# EAGLE design draft4_4lyr_autoroute (EAGLE 6.1)
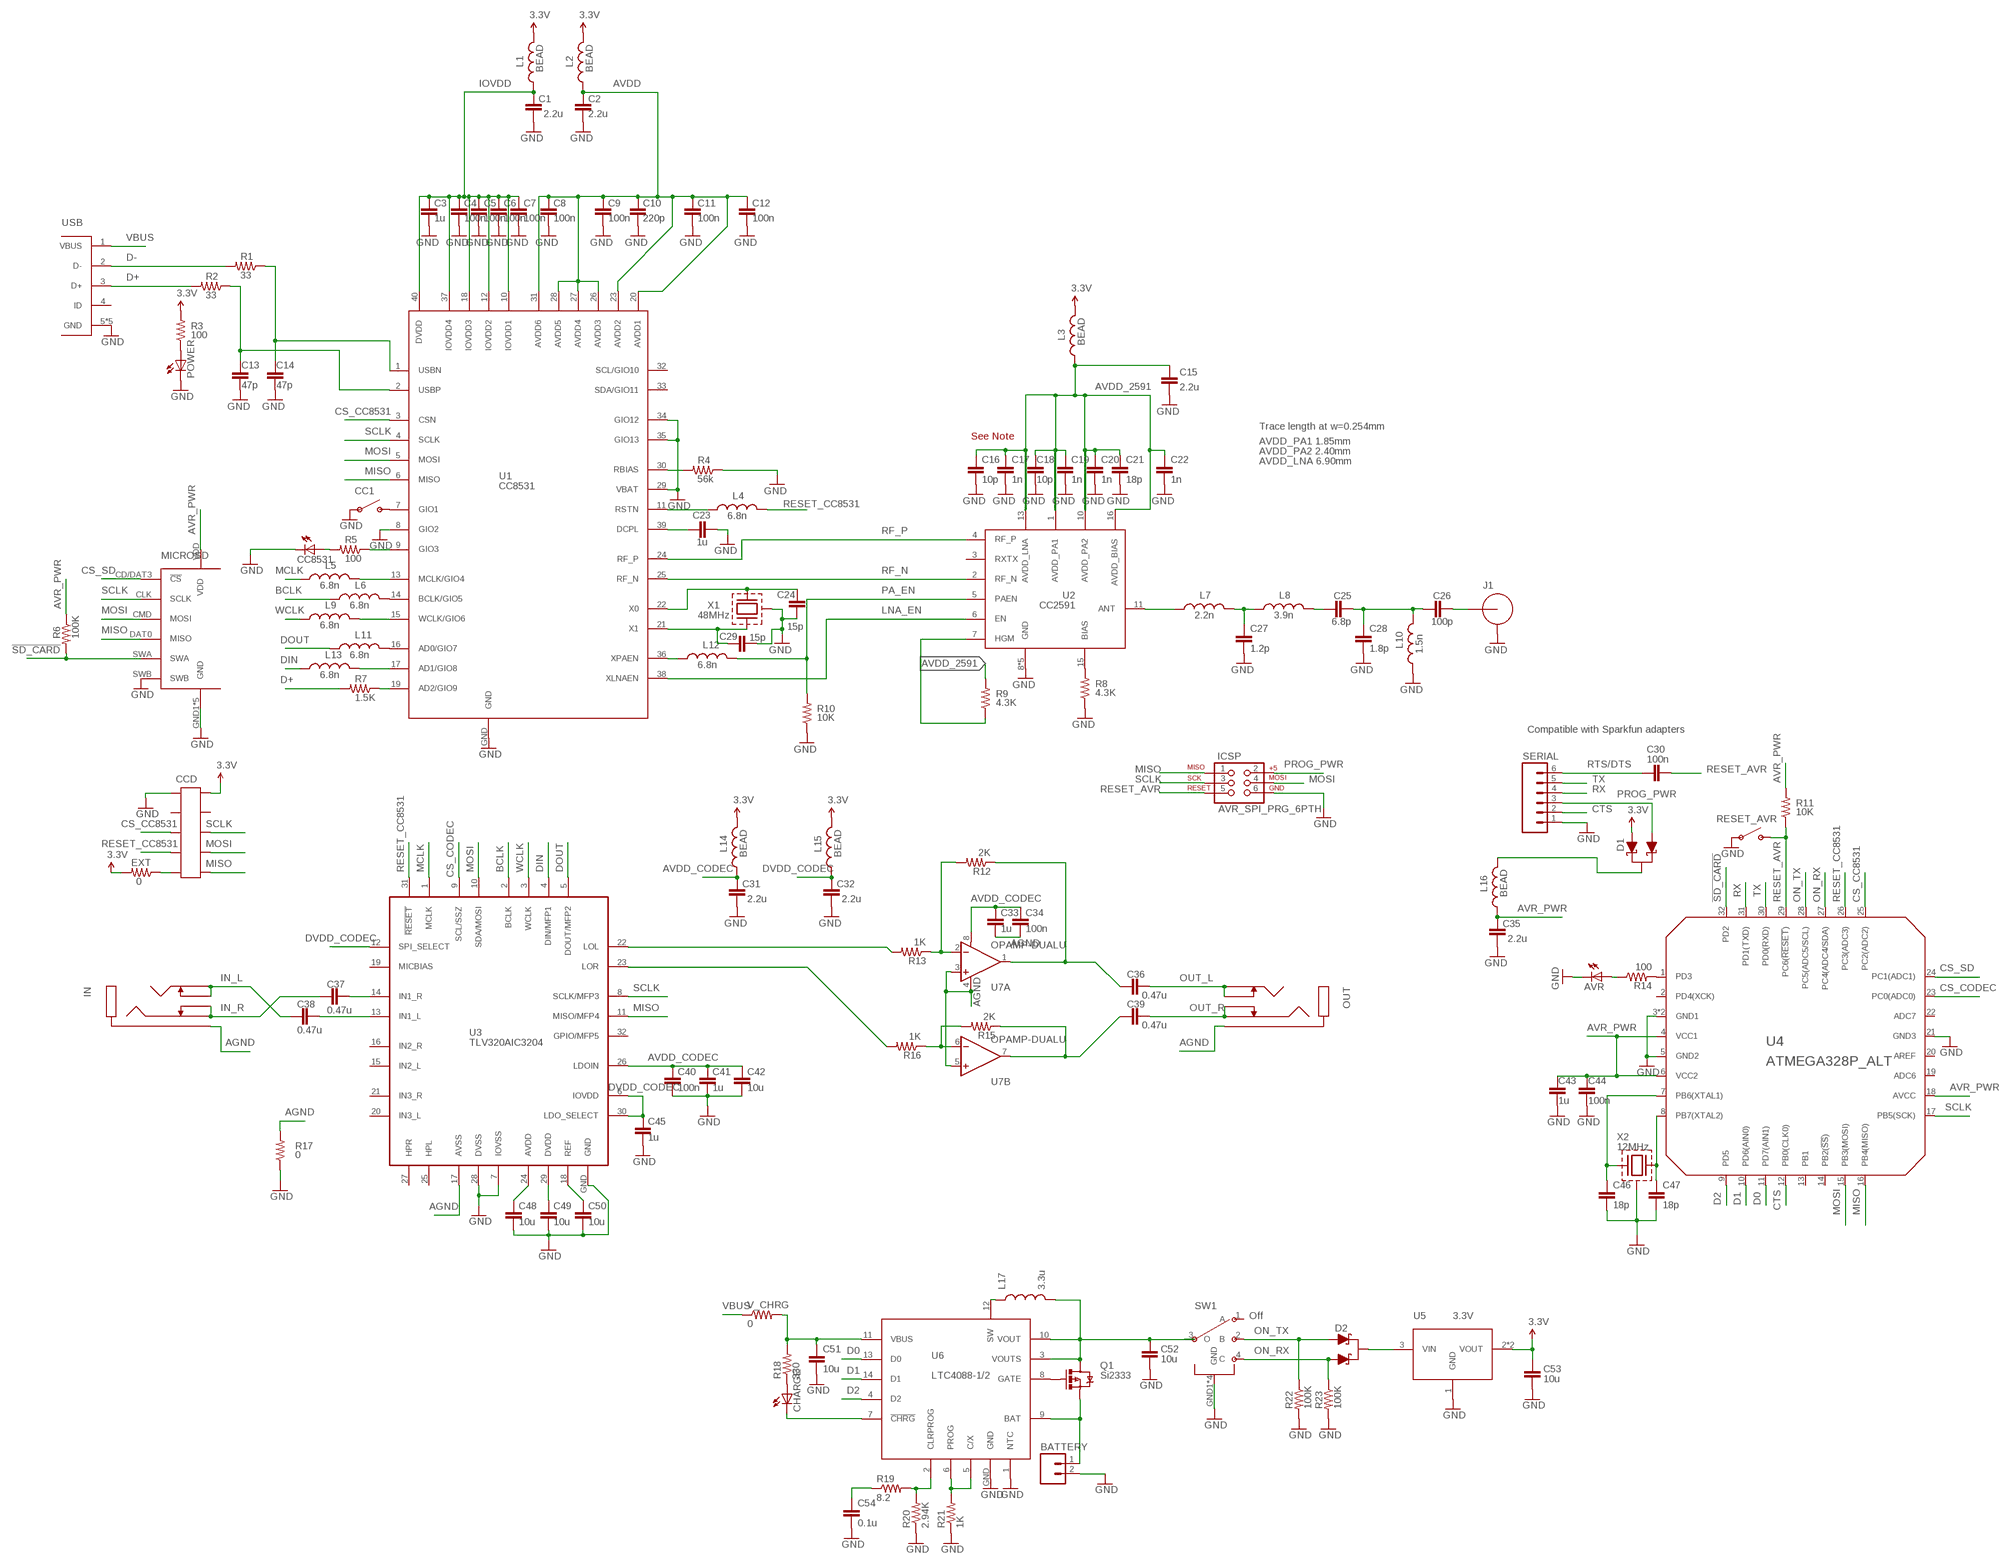
[diagram p0: schematic, sheet 1]

## Parts
AVR  LED1206  [LED-1206]
BATTERY  M02-JST-2MM-SMT  [JST-2-SMD]
C1  2.2u  C-EUC0603  [C0603]
C2  2.2u  C-EUC0603  [C0603]
C3  1u  C-EUC0603  [C0603]
C4  100n  C-EUC0603  [C0603]
C5  100n  C-EUC0603  [C0603]
C6  100n  C-EUC0603  [C0603]
C7  100n  C-EUC0603  [C0603]
C8  100n  C-EUC0603  [C0603]
C9  100n  C-EUC0603  [C0603]
C10  220p  C-EUC0603  [C0603]
C11  100n  C-EUC0603  [C0603]
C12  100n  C-EUC0603  [C0603]
C13  47p  C-EUC0603  [C0603]
C14  47p  C-EUC0603  [C0603]
C15  2.2u  C-EUC0603  [C0603]
C16  10p  C-EUC0603  [C0603]
C17  1n  C-EUC0603  [C0603]
C18  10p  C-EUC0603  [C0603]
C19  1n  C-EUC0603  [C0603]
C20  1n  C-EUC0603  [C0603]
C21  18p  C-EUC0603  [C0603]
C22  1n  C-EUC0603  [C0603]
C23  1u  C-EUC0603  [C0603]
C24  15p  C-EUC0603  [C0603]
C25  6.8p  C-EUC0603  [C0603]
C26  100p  C-EUC0603  [C0603]
C27  1.2p  C-EUC0603  [C0603]
C28  1.8p  C-EUC0603  [C0603]
C29  15p  C-EUC0603  [C0603]
C30  100n  C-EUC0603  [C0603]
C31  2.2u  C-EUC0603  [C0603]
C32  2.2u  C-EUC0603  [C0603]
C33  1u  C-EUC0603  [C0603]
C34  100n  C-EUC0603  [C0603]
C35  2.2u  C-EUC0603  [C0603]
C36  0.47u  C-EUC0603  [C0603]
C37  0.47u  C-EUC0603  [C0603]
C38  0.47u  C-EUC0603  [C0603]
C39  0.47u  C-EUC0603  [C0603]
C40  100n  C-EUC0603  [C0603]
C41  1u  C-EUC0603  [C0603]
C42  10u  C-EUC0603  [C0603]
C43  1u  C-EUC0603  [C0603]
C44  100n  C-EUC0603  [C0603]
C45  1u  C-EUC0603  [C0603]
C46  18p  C-EUC0603  [C0603]
C47  18p  C-EUC0603  [C0603]
C48  10u  C-EUC0603  [C0603]
C49  10u  C-EUC0603  [C0603]
C50  10u  C-EUC0603  [C0603]
C51  10u  C-EUC0603  [C0603]
C52  10u  C-EUC0603  [C0603]
C53  10u  C-EUC0603  [C0603]
C54  0.1u  C-EUC0603  [C0603]
CC1  SPST-SMD  [TACT_SW]
CC8531  LED1206  [LED-1206]
CCD  HEADER-10P-PTH-MALE  [2X5]
CHARGE  LED1206  [LED-1206]
D1  DUAL_SCHOTTKY  [SOT-23]
D2  DUAL_SCHOTTKY  [SOT-23]
EXT  0  R-US_R0603  [R0603]
ICSP  AVR_SPI_PRG_6PTH  [2X3]
IN  PHONE_SW  [35RAPC4BV4]
J1  SMA  [CONSMA003.031]
L1  BEAD  INDUCTOR0603  [0603]
L2  BEAD  INDUCTOR0603  [0603]
L3  BEAD  INDUCTOR0603  [0603]
L4  6.8n  INDUCTOR0603  [0603]
L5  6.8n  INDUCTOR0603  [0603]
L6  6.8n  INDUCTOR0603  [0603]
L7  2.2n  INDUCTOR0603  [0603]
L8  3.9n  INDUCTOR0603  [0603]
L9  6.8n  INDUCTOR0603  [0603]
L10  1.5n  INDUCTOR0603  [0603]
L11  6.8n  INDUCTOR0603  [0603]
L12  6.8n  INDUCTOR0603  [0603]
L13  6.8n  INDUCTOR0603  [0603]
L14  BEAD  INDUCTOR0603  [0603]
L15  BEAD  INDUCTOR0603  [0603]
L16  BEAD  INDUCTOR0603  [0603]
L17  3.3u  IFSC-1111AB-01  [IFSC-1111AB-01]
MICROSD  MICROSD104031-0811  [MOLEX_104031-0811]
OUT  PHONE_SW  [35RAPC4BV4]
POWER  LED1206  [LED-1206]
Q1  Si2333  MOSFET-PCHANNELSMD  [SOT23-3]
R1  33  R-US_R0603  [R0603]
R2  33  R-US_R0603  [R0603]
R3  100  R-US_R0603  [R0603]
R4  56k  R-US_R0603  [R0603]
R5  100  R-US_R0603  [R0603]
R6  100K  R-US_R0603  [R0603]
R7  1.5K  R-US_R0603  [R0603]
R8  4.3K  R-US_R0603  [R0603]
R9  4.3K  R-US_R0603  [R0603]
R10  10K  R-US_R0603  [R0603]
R11  10K  R-US_R0603  [R0603]
R12  2K  R-US_R0603  [R0603]
R13  1K  R-US_R0603  [R0603]
R14  100  R-US_R0603  [R0603]
R15  2K  R-US_R0603  [R0603]
R16  1K  R-US_R0603  [R0603]
R17  0  R-US_R0603  [R0603]
R18  330  R-US_R0603  [R0603]
R19  8.2  R-US_R0603  [R0603]
R20  2.94K  R-US_R0603  [R0603]
R21  1K  R-US_R0603  [R0603]
R22  100K  R-US_R0603  [R0603]
R23  100K  R-US_R0603  [R0603]
RESET_AVR  SPST-SMD  [TACT_SW]
SERIAL  M06SIP  [1X06]
SW1  SP3T-SSSS812201  [SSSS812201]
U1  CC8531  [S-PVQFN-N40]
U2  CC2591  [S-PVQFN-N16]
U3  TLV320AIC3204  [S-PVQFN-N32]
U4  ATMEGA328P_ALT  [S-PQFP-N32]
U5  3.3V  NX1117C  [SOT-223]
U6  LTC4088-1/2  [DFN-14]
U7  OPAMP-DUALU  [SO08]
USB  USB_MICRO_AB  [USB_MICRO_AB]
V_CHRG  0  R-US_R0603  [R0603]
X1  48MHz  XTAL-ABRACONABM3C  [ABM3C]
X2  12MHz  XTAL-ABRACONABM8G  [ABM8G]

## Nets
3.3V [Power]: C53.1 CCD.2 D1.1(A1) EXT.2 L1.2 L2.2 L3.2 L14.2 L15.2 R3.2 U5.2(VOUT) U5.4(VOUT)
!SD_CARD: MICROSD.SWA R6.2 U4.32(PD2)
AGND [Analog]: C33.2 C34.2 IN.1(GND) OUT.1(GND) R17.2 U3.17(AVSS) U7.3(A:+IN) U7.4(A:V-) U7.5(B:+IN)
AVDD: C2.1 C8.1 C9.1 C10.1 C11.1 C12.1 L2.1 U1.20(AVDD1) U1.23(AVDD2) U1.26(AVDD3) U1.27(AVDD4) U1.28(AVDD5) U1.31(AVDD6)
AVDD_2591: C15.1 C16.1 C17.1 C18.1 C19.1 C20.1 C21.1 C22.1 L3.1 R9.2 U2.1(AVDD_PA1) U2.10(AVDD_PA2) U2.13(AVDD_LNA) U2.16(AVDD_BIAS)
AVDD_CODEC: C31.1 C33.1 C34.1 C40.1 C41.1 C42.1 L14.1 U3.26(LDOIN) U7.8(A:V+)
AVR_PWR: C35.1 C43.1 C44.1 L16.1 MICROSD.VDD R6.1 R11.2 U4.4(VCC1) U4.6(VCC2) U4.18(AVCC)
BAT [Power]: BATTERY.1 Q1.2(S) U6.9(BAT)
BCLK: L6.1 U3.2(BCLK)
CS_CC8531: CCD.5 U1.3(CSN) U4.25(PC2(ADC2))
CS_CODEC: U3.9(SCL/SSZ) U4.23(PC0(ADC0))
CS_SD: MICROSD.CD/DAT3(!CS) U4.24(PC1(ADC1))
CTS: SERIAL.2 U4.12(PB0(CLK0))
D0: U4.11(PD7(AIN1)) U6.13(D0)
D1: U4.10(PD6(AIN0)) U6.14(D1)
D2: U4.9(PD5) U6.4(D2)
D+: R2.2 R7.2 USB.3(D+)
D-: R1.2 USB.2(D-)
DIN: L13.1 U3.4(DIN/MFP1)
DOUT: L11.1 U3.5(DOUT/MFP2)
DVDD: C49.1 U3.29(DVDD)
DVDD_CODEC: C32.1 C45.1 L15.1 U3.6(IOVDD) U3.12(SPI_SELECT) U3.30(LDO_SELECT)
GND [Power]: AVR.C BATTERY.2 C1.2 C2.2 C3.2 C4.2 C5.2 C6.2 C7.2 C8.2 C9.2 C10.2 C11.2 C12.2 C13.2 C14.2 C15.2 C16.2 C17.2 C18.2 C19.2 C20.2 C21.2 C22.2 C23.2 C24.2 C27.2 C28.2 C29.2 C31.2 C32.2 C35.2 C40.2 C41.2 C42.2 C43.2 C44.2 C45.2 C46.2 C47.2 C48.2 C49.2 C50.2 C51.2 C52.2 C53.2 C54.2 CC1.1 CC1.2 CC8531.C CCD.1 ICSP.6 J1.GND1(GND) J1.GND2(GND) J1.GND3(GND) J1.GND4(GND) L10.1 MICROSD.GND1(GND) MICROSD.GND2(GND) MICROSD.GND3(GND) MICROSD.GND4(GND) MICROSD.SWB MICROSD.VSS(GND) POWER.C R4.1 R8.1 R10.1 R17.1 R20.1 R21.1 R22.2 R23.2 RESET_AVR.1 RESET_AVR.2 SERIAL.1 SW1.GND1(GND) SW1.GND2(GND) SW1.GND3(GND) SW1.GND4(GND) U1.8(GIO2) U1.29(VBAT) U1.34(GIO12) U1.35(GIO13) U1.GND U2.8(GND) U2.9(GND) U2.12(GND) U2.14(GND) U2.GND U3.7(IOVSS) U3.28(DVSS) U3.GND U4.3(GND1) U4.5(GND2) U4.21(GND3) U4.P$1(GND1) U5.1(GND) U6.1(NTC) U6.GND USB.5(GND) USB.GND1(GND) USB.GND2(GND) USB.GND3(GND) USB.GND4(GND) X1.2(CASE) X1.4(CASE) X2.GND-1(CASE) X2.GND-2(CASE)
IN_L [Analog]: C38.1 IN.2(L) IN.5(L_SW)
IN_R [Analog]: C37.1 IN.3(R_SW) IN.4(R)
IOVDD: C1.1 C3.1 C4.1 C5.1 C6.1 C7.1 L1.1 U1.10(IOVDD1) U1.12(IOVDD2) U1.18(IOVDD3) U1.37(IOVDD4) U1.40(DVDD)
IOVDD1: C14.1 R1.1 U1.1(USBN)
IOVDD2: C13.1 R2.1 U1.2(USBP)
LNA_EN: U1.38(XLNAEN) U2.6(EN)
MCLK: L5.1 U3.1(MCLK)
MISO: CCD.10 ICSP.1 MICROSD.DAT0(MISO) U1.6(MISO) U3.11(MISO/MFP4) U4.16(PB4(MISO))
MOSI: CCD.8 ICSP.4 MICROSD.CMD(MOSI) U1.5(MOSI) U3.10(SDA/MOSI) U4.15(PB3(MOSI))
N$1: C29.1 U1.21(X1) X1.1
N$2: C24.1 U1.22(X0) X1.3
N$3: L4.1 U1.11(RSTN)
N$4: L11.2 U1.16(AD0/GIO7)
N$5: L6.2 U1.14(BCLK/GIO5)
N$6: D1.3(C1) L16.2
N$7: R8.2 U2.15(BIAS)
N$8: R9.1 U2.7(HGM)
N$9: C26.2 J1.SIG
N$10: D2.3(C1) U5.3(VIN)
N$11: CC1.3 CC1.4 U1.7(GIO1)
N$12: C46.1 U4.7(PB6(XTAL1)) X2.X1
N$13: L7.1 U2.11(ANT)
N$14: C27.1 L7.2 L8.1
N$15: C25.1 L8.2
N$16: C25.2 C26.1 C28.1 L10.2
N$17: C48.1 U3.24(AVDD)
N$18: L12.1 U1.36(XPAEN)
N$19: R4.2 U1.30(RBIAS)
N$20: C47.1 U4.8(PB7(XTAL2)) X2.X2
N$21: C23.1 U1.39(DCPL)
N$23: L5.2 U1.13(MCLK/GIO4)
N$24: R7.1 U1.19(AD2/GIO9)
N$25: L9.2 U1.15(WCLK/GIO6)
N$27: L13.2 U1.17(AD1/GIO8)
N$28: R5.1 U1.9(GIO3)
N$29: CC8531.A R5.2
N$31: POWER.A R3.1
N$32: CHARGE.C U6.7(!CHRG)
N$33: CHARGE.A R18.1
N$34 [Analog]: C37.2 U3.14(IN1_R)
N$35 [Analog]: C38.2 U3.13(IN1_L)
N$36: L17.1 U6.12(SW)
N$37: R21.2 U6.5(C/X) U6.6(PROG)
N$38: R19.2 R20.2 U6.2(CLRPROG)
N$39: C36.1 R12.1 U7.1(A:OUT)
N$40: C39.1 R15.1 U7.7(B:OUT)
N$46: R14.2 U4.1(PD3)
N$47: AVR.A R14.1
N$48: C54.1 R19.1
N$49 [Power]: C52.1 L17.2 Q1.3(D) SW1.3(O) U6.3(VOUTS) U6.10(VOUT)
N$50: CCD.9 EXT.1
N$51: Q1.1(G) U6.8(GATE)
N$52 [Power]: C51.1 R18.2 U6.11(VBUS) V_CHRG.2
N$53: R12.2 R13.1 U7.2(A:-IN)
N$54: R15.2 R16.1 U7.6(B:-IN)
N$55: R13.2 U3.22(LOL)
N$56: R16.2 U3.23(LOR)
ON_RX: D2.2(A) R23.1 SW1.4(C) U4.27(PC4(ADC4/SDA))
ON_TX: D2.1(A1) R22.1 SW1.2(B) U4.28(PC5(ADC5/SCL))
OUT_L [Analog]: C36.2 OUT.2(L) OUT.5(L_SW)
OUT_R [Analog]: C39.2 OUT.3(R_SW) OUT.4(R)
PA_EN: L12.2 R10.2 U2.5(PAEN)
PROG_PWR: D1.2(A) ICSP.2 SERIAL.3
REF: C50.1 U3.18(REF)
RESET_AVR: C30.2 ICSP.5 R11.1 RESET_AVR.3 RESET_AVR.4 U4.29(PC6(!RESET!))
RESET_CC8531: CCD.7 L4.2 U3.31(!RESET) U4.26(PC3(ADC3))
RF_N: U1.25(RF_N) U2.2(RF_N)
RF_P: U1.24(RF_P) U2.4(RF_P)
RTS/DTS: C30.1 SERIAL.6
RX: SERIAL.4 U4.31(PD1(TXD))
SCLK: CCD.6 ICSP.3 MICROSD.CLK(SCLK) U1.4(SCLK) U3.8(SCLK/MFP3) U4.17(PB5(SCK))
TX: SERIAL.5 U4.30(PD0(RXD))
VBUS [Power]: USB.1(VBUS) V_CHRG.1
WCLK: L9.1 U3.3(WCLK)
Unconnected: CCD.3 CCD.4 SW1.1(A) U1.32(SCL/GIO10) U1.33(SDA/GIO11) U2.3(RXTX) U3.15(IN2_L) U3.16(IN2_R) U3.19(MICBIAS) U3.20(IN3_L) U3.21(IN3_R) U3.25(HPL) U3.27(HPR) U3.32(GPIO/MFP5) U4.2(PD4(XCK)) U4.13(PB1) U4.14(PB2(!SS!)) U4.19(ADC6) U4.20(AREF) U4.22(ADC7) USB.4(ID)

## Notes on the sheet
- Trace length at w=0.254mm
- See Note
- AVDD_PA1 1.85mm
- AVDD_PA2 2.40mm
- AVDD_LNA 6.90mm
- Compatible with Sparkfun adapters
- Off

## Library data of the parts
AVR CC8531 CHARGE POWER = SparkFun-LED:LED: LEDs Standard schematic elements and footprints for 5mm, 3mm, 1206, and 0603 sized LEDs. 5mm - Spark Fun Electronics SKU : COM-00529 (and others)
BATTERY = SparkFun-Connectors:M02: Header 2 Standard 2-pin 0.1" header. Use with straight break away headers (SKU : PRT-00116), right angle break away headers (PRT-00553), swiss pins (PRT-00743), machine pins (PRT-00117), and female headers (PRT-00115). Molex polarized connector foot print use with SKU : PRT-08233 with associated crimp pins and housings.
C1-C45 C48-C50 C52 C53 = rcl:C-EU: CAPACITOR, European symbol
C46 C47 C51 C54 = 00-EvaLibrary:C-EU: CAPACITOR, European symbol
CC1 RESET_AVR = 00-EvaLibrary:SPST
CCD = 00-EvaLibrary:HEADER-10P
D1 D2 = 00-EvaLibrary:DUAL_SCHOTTKY
EXT R1-R11 R14 R17 R22 R23 = rcl:R-US_: RESISTOR, American symbol
ICSP = SparkFun-Connectors:AVR_SPI_PRG_6: AVR ISP 6 Pin This is the reduced ISP connector for AVR programming. Common on Arduino. This footprint will take up less PCB space and can be used with a 10-pin to 6-pin adapter such as SKU: BOB-08508
IN OUT = 00-EvaLibrary:PHONE_SW
J1 = 00-EvaLibrary:SMA
L1-L16 = SparkFun-Passives:INDUCTOR: Inductors Basic Inductor/Choke - 0603 and 1206. Footprints are not proven and vary greatly between part numbers.
L17 = 00-EvaLibrary:IFSC-1111AB-01
MICROSD = 00-EvaLibrary:MICROSD
Q1 = SparkFun-DiscreteSemi:MOSFET-PCHANNEL: Generic PMOSFET
R12 R13 R15 R16 R18-R21 V_CHRG = 00-EvaLibrary:R-US_: RESISTOR, American symbol
SERIAL = SparkFun-Connectors:M06: Header 6 Standard 6-pin 0.1" header. Use with straight break away headers (SKU : PRT-00116), right angle break away headers (PRT-00553), swiss pins (PRT-00743), machine pins (PRT-00117), and female headers (PRT-00115). Molex polarized connector foot print use with SKU : PRT-08094 with associated crimp pins and housings. NOTES ON THE VARIANTS LOCK and LOCK_LONGPADS... This footprint was designed to help hold the alignment of a through-hole component (i.e. 6-pin header) while soldering it into place. You may notice that each hole has been shifted either up or down by 0.005 of an inch from it's more standard position (which is a perfectly straight line). This slight alteration caused the pins (the squares in the middle) to touch the edges of the holes. Because they are alternating, it causes a "brace" to hold the component in place. 0.005 has proven to be the perfect amount of "off-center" position when using our standard breakaway headers. Although looks a little odd when you look at the bare footprint, once you have a header in there, the alteration is very hard to notice. Also, if you push a header all the way into place, it is covered up entirely on the bottom side. This idea of altering the position of holes to aid alignment will be further integrated into the Sparkfun Library for other footprints. It can help hold any component with 3 or more connection pins.
SW1 = 00-EvaLibrary:SP3T
U1 = 00-EvaLibrary:CC8531
U2 = 00-EvaLibrary:CC2591
U3 = 00-EvaLibrary:TLV320AIC3204
U4 = 00-EvaLibrary:ATMEGA328P_ALT
U5 = 00-EvaLibrary:NX1117C
U6 = 00-EvaLibrary:LTC4088-1/2
U7 = SparkFun-AnalogIC:OPAMP-DUAL: Generic op-amp footprint
USB = 00-EvaLibrary:USB_MICRO_AB
X1 X2 = 00-EvaLibrary:XTAL-ABRACON

## Board
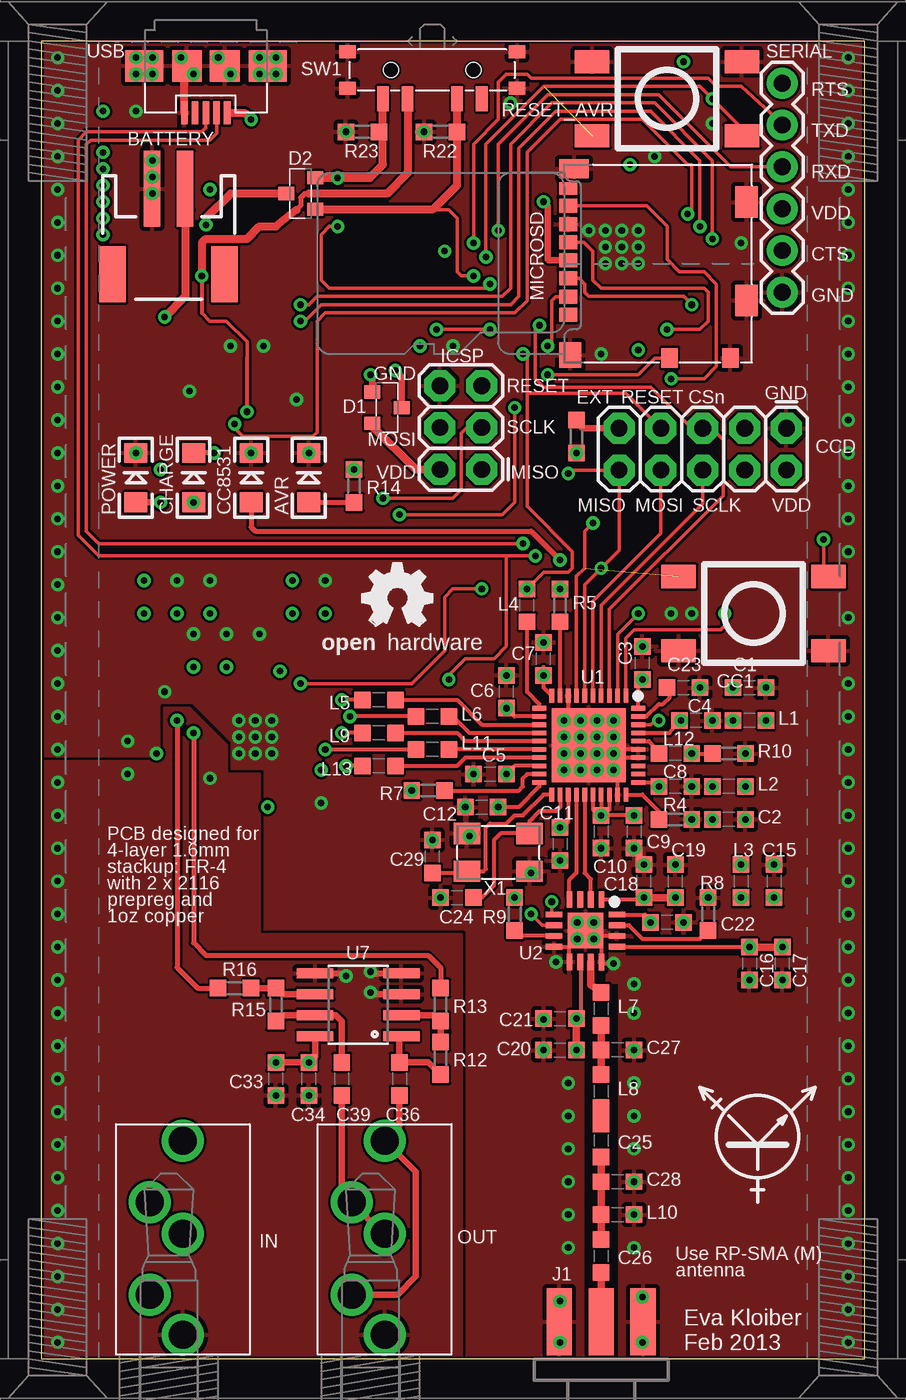
[diagram p1: board, top side]
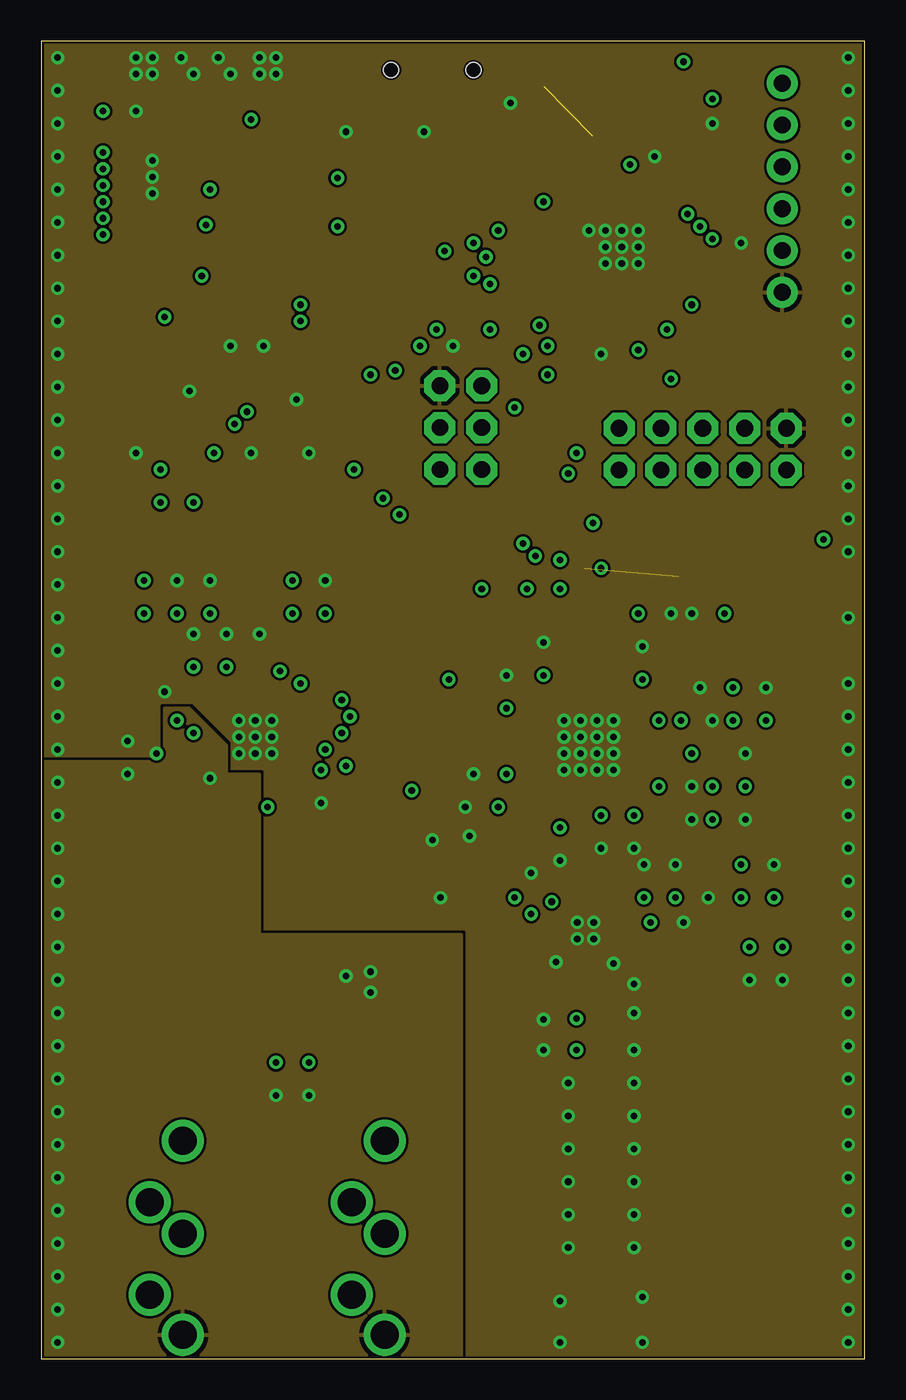
[diagram p2: board, inner layer Ground]
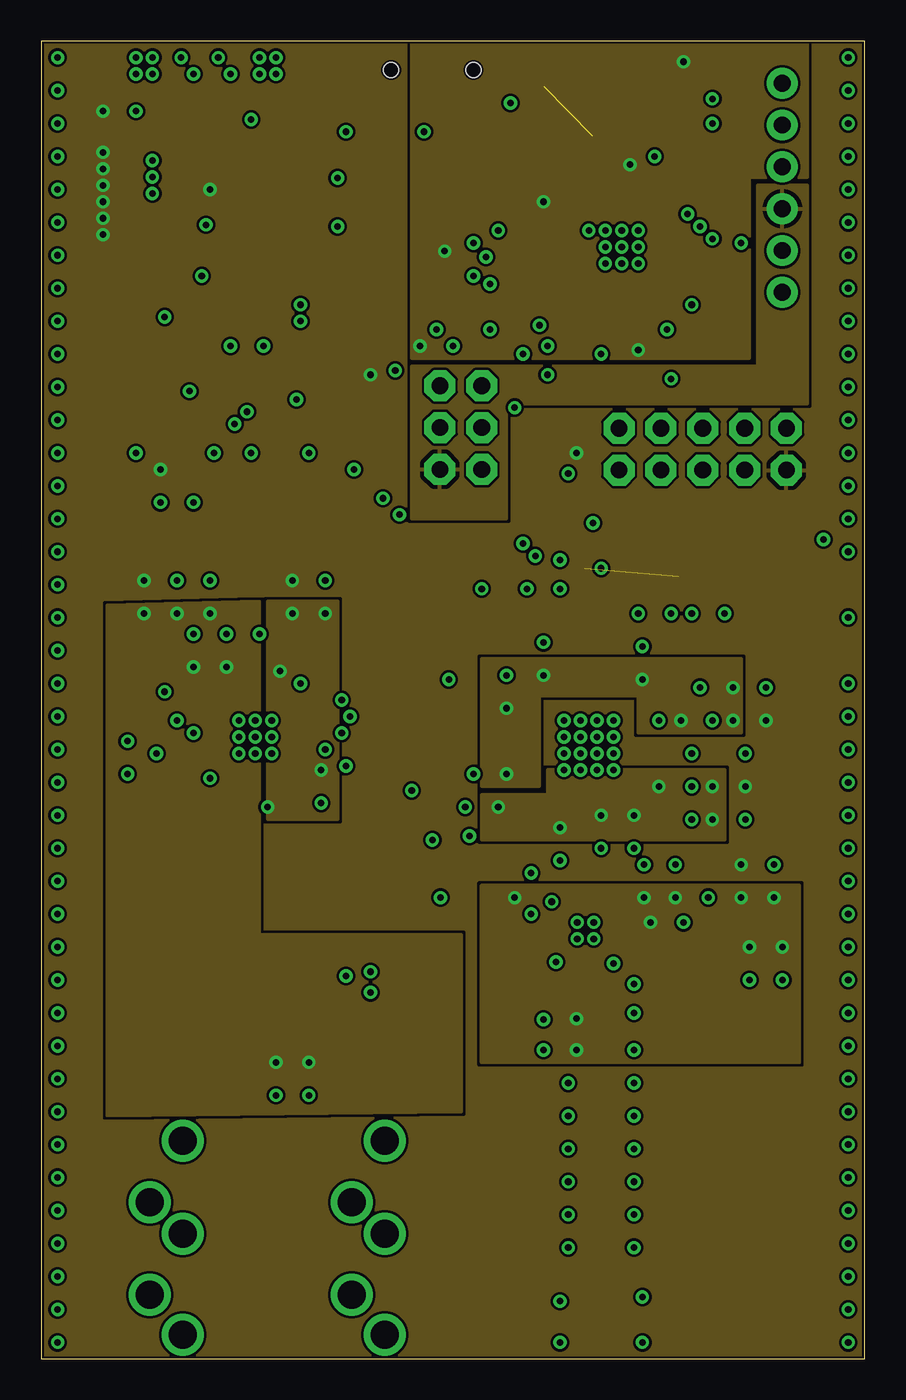
[diagram p3: board, inner layer Power]
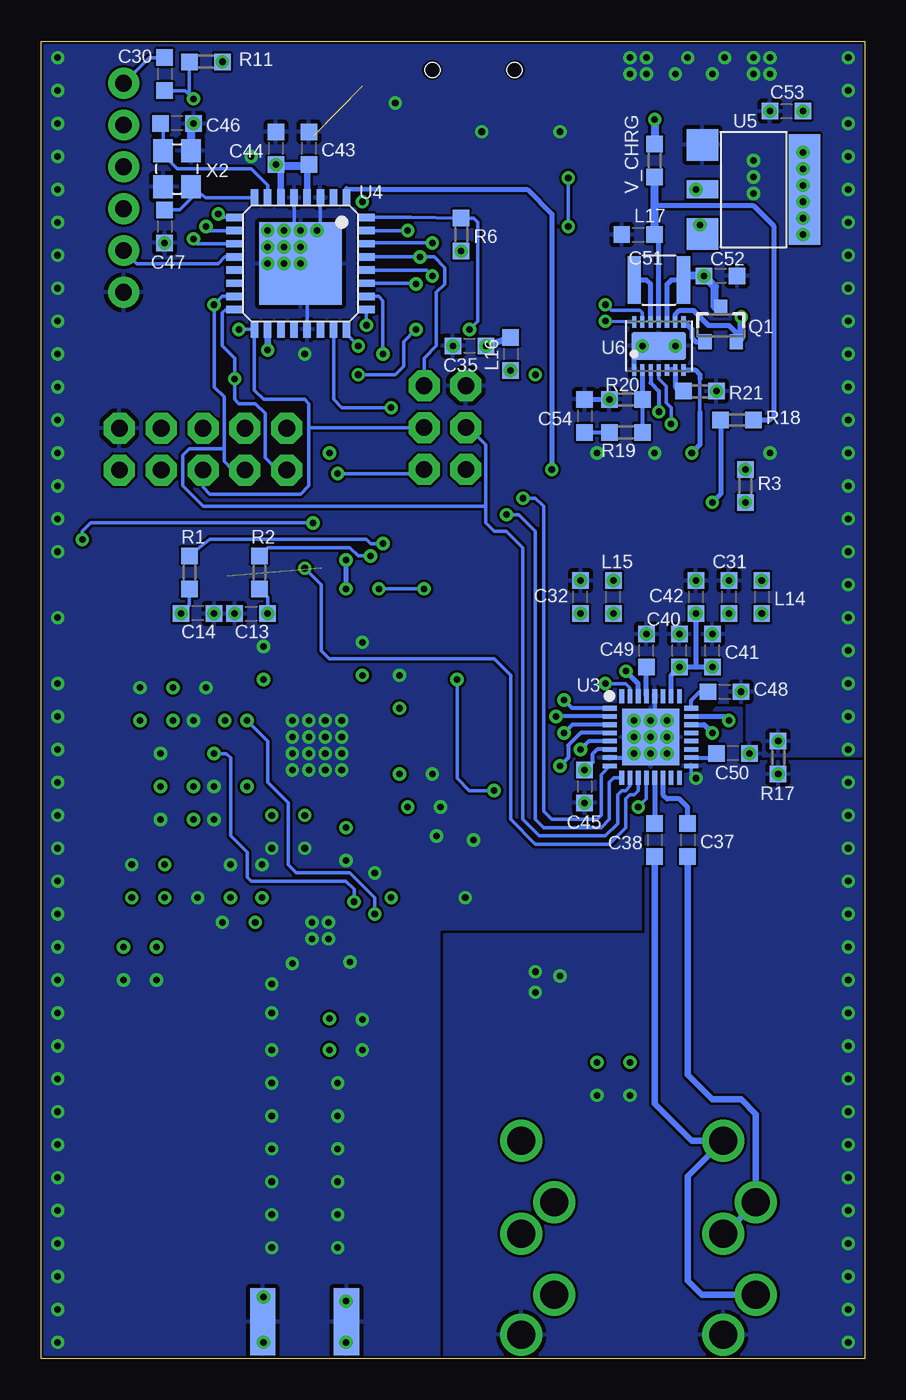
[diagram p4: board, bottom side, seen from below]

Size 50 x 80 mm. Coordinates in mm from the lower left corner, seen from the top.
Outline: 0,0 50,0 50,80 0,80 0,0
Copper layers (1+2*3+16): Top 0.034290625mm / dielectric 0.24891875mm / Ground 0.034290625mm / dielectric 39mil / Power 0.034290625mm / dielectric 0.24891875mm / Bottom 0.034290625mm
Design rules: minimum track width 6mil, minimum drill 15mil, track to track 6mil, track to pad 6mil, pad to pad 6mil, via to via 6mil, smd to smd 0mil, copper to edge 6mil, drill to drill 6mil, minimum pad ring 10mil, minimum via ring 8mil, stop-mask expansion 4mil, vias tented up to drill 0mil, thermal gap 10mil
tRestrict: area 33,0.2 to 35,22.8; area 32.2,21.2 to 33,23.2; area 33,22.8 to 34.2,23.5; area 35.5,24.5 to 42.5,25.5; area 34,27.5 to 36.2,28.5; area 31.8,28 to 33.8,34.8

### Footprints (pad centres in the part's own frame; a part is rotated, then mirrored left to right if it is on the bottom)
LED-1206 = smd 1.2 x 1.4: A -1.5,0; C 1.5,0
JST-2-SMD = smd 1 x 4.6: 1 -1,-3.7; 2 1,-3.7 | smd 1.6 x 3.4: NC1 -3.4,1.5; NC2 3.4,1.5
C0603 = smd 1 x 1: 1 -1,0; 2 1,0
TACT_SW = smd 1.4 x 2.1: 1 2.25,4.55; 2 2.25,-4.55; 3 -2.25,4.55; 4 -2.25,-4.55
2X5 = drill 1.016 pad 1.88 octagon: 1 0,0; 2 0,2.54; 3 2.54,0; 4 2.54,2.54; 5 5.08,0; 6 5.08,2.54; 7 7.62,0; 8 7.62,2.54; 9 10.16,0; 10 10.16,2.54
SOT-23 = smd 0.802 x 0.972: 1 -0.95,-0.885; 2 0.95,-0.885; 3 0,0.885
R0603 = smd 1 x 1: 1 -1,0; 2 1,0
2X3 = drill 1.016 pad 1.88 octagon: 1 0,0; 2 0,2.54; 3 2.54,0; 4 2.54,2.54; 5 5.08,0; 6 5.08,2.54
35RAPC4BV4 = drill 1.7 pad 2.4: 1 1.2,-0.85; 2 3.65,1.15; 3 7.35,-0.85; 4 9.25,1.15; 5 13,-0.85
CONSMA003.031 = smd 4.064 x 1.524: GND1 0,2.54; GND2 0,-2.54; SIG 0,0 | smd 4.064 x 1.524 bottom: GND3 0,2.54; GND4 0,-2.54
0603 = smd 1 x 1: 1 -1,0; 2 1,0
IFSC-1111AB-01 = smd 0.8 x 2.9: 1 -1.5,0; 2 1.5,0
MOLEX_104031-0811 = smd 0.85 x 1.1: CD/DAT3 2.005,0.25; CLK -1.295,0.25; CMD 0.905,0.25; DAT0 -3.495,0.25; DAT2 3.105,0.25; VDD -0.195,0.25; VSS -2.395,0.25 | smd 0.75 x 1.1: DAT1 -4.545,0.25 | smd 1.55 x 1.35: GND1 5.565,0.375 | smd 1.17 x 1.8: GND2 -5.755,0.6 | smd 1.9 x 1.35: GND3 -3.73,11.075; GND4 2.24,11.075 | smd 1.2 x 1: SWA 5.74,6.4; SWB 5.74,10.1
SOT23-3 = smd 0.8 x 0.9: 1 -0.95,-1; 2 0.95,-1; 3 0,1.1
1X06 = drill 1.016 pad 1.88: 1 0,0; 2 2.54,0; 3 5.08,0; 4 7.62,0; 5 10.16,0; 6 12.7,0
SSSS812201 = smd 0.7 x 1.5: 1 -3,1.75; 2 -1.5,1.75; 3 1.5,1.75; 4 3,1.75 | smd 1 x 0.8: GND1 -5.15,-1.1; GND2 -5.15,1.1; GND3 5.15,-1.1; GND4 5.15,1.1 | hole 0.9: -2.5,0; 2.5,0
S-PVQFN-N40 = smd 0.85 x 0.28: 1 -3,2.25; 2 -3,1.75; 3 -3,1.25; 4 -3,0.75; 5 -3,0.25; 6 -3,-0.25; 7 -3,-0.75; 8 -3,-1.25; 9 -3,-1.75; 10 -3,-2.25; 21 3,-2.25; 22 3,-1.75; 23 3,-1.25; 24 3,-0.75; 25 3,-0.25; 26 3,0.25; 27 3,0.75; 28 3,1.25; 29 3,1.75; 30 3,2.25 | smd 0.28 x 0.85: 11 -2.25,-3; 12 -1.75,-3; 13 -1.25,-3; 14 -0.75,-3; 15 -0.25,-3; 16 0.25,-3; 17 0.75,-3; 18 1.25,-3; 19 1.75,-3; 20 2.25,-3; 31 2.25,3; 32 1.75,3; 33 1.25,3; 34 0.75,3; 35 0.25,3; 36 -0.25,3; 37 -0.75,3; 38 -1.25,3; 39 -1.75,3; 40 -2.25,3 | smd 4.5 x 4.5: GND 0,0
S-PVQFN-N16 = smd 1 x 0.35: 1 -1.9,0.975; 2 -1.9,0.325; 3 -1.9,-0.325; 4 -1.9,-0.975; 9 1.9,-0.975; 10 1.9,-0.325; 11 1.9,0.325; 12 1.9,0.975 | smd 0.35 x 1: 5 -0.975,-1.9; 6 -0.325,-1.9; 7 0.325,-1.9; 8 0.975,-1.9; 13 0.975,1.9; 14 0.325,1.9; 15 -0.325,1.9; 16 -0.975,1.9 | smd 2.16 x 2.16: GND 0,0
S-PVQFN-N32 = smd 0.85 x 0.28: 1 -2.475,1.75; 2 -2.475,1.25; 3 -2.475,0.75; 4 -2.475,0.25; 5 -2.475,-0.25; 6 -2.475,-0.75; 7 -2.475,-1.25; 8 -2.475,-1.75; 17 2.475,-1.75; 18 2.475,-1.25; 19 2.475,-0.75; 20 2.475,-0.25; 21 2.475,0.25; 22 2.475,0.75; 23 2.475,1.25; 24 2.475,1.75 | smd 0.28 x 0.85: 9 -1.75,-2.475; 10 -1.25,-2.475; 11 -0.75,-2.475; 12 -0.25,-2.475; 13 0.25,-2.475; 14 0.75,-2.475; 15 1.25,-2.475; 16 1.75,-2.475; 25 1.75,2.475; 26 1.25,2.475; 27 0.75,2.475; 28 0.25,2.475; 29 -0.25,2.475; 30 -0.75,2.475; 31 -1.25,2.475; 32 -1.75,2.475 | smd 3.45 x 3.45: GND 0,0
S-PQFP-N32 = smd 0.45 x 1: 1 -2.8,-4; 2 -2,-4; 3 -1.2,-4; 4 -0.4,-4; 5 0.4,-4; 6 1.2,-4; 7 2,-4; 8 2.8,-4; 17 2.8,4; 18 2,4; 19 1.2,4; 20 0.4,4; 21 -0.4,4; 22 -1.2,4; 23 -2,4; 24 -2.8,4 | smd 1 x 0.45: 9 4,-2.8; 10 4,-2; 11 4,-1.2; 12 4,-0.4; 13 4,0.4; 14 4,1.2; 15 4,2; 16 4,2.8; 25 -4,2.8; 26 -4,2; 27 -4,1.2; 28 -4,0.4; 29 -4,-0.4; 30 -4,-1.2; 31 -4,-2; 32 -4,-2.8 | smd 5 x 5: P$1 0,0
SOT-223 = smd 1.9 x 1.9: 1 -2.7,-3.1; 3 2.7,-3.1 | smd 1.1 x 1.9: 2 0,-3.1 | smd 6.7 x 1.9: 4 0,3.1
DFN-14 = smd 0.25 x 0.7: 1 -1.5,-1.45; 2 -1,-1.45; 3 -0.5,-1.45; 4 0,-1.45; 5 0.5,-1.45; 6 1,-1.45; 7 1.5,-1.45; 8 1.5,1.45; 9 1,1.45; 10 0.5,1.45; 11 0,1.45; 12 -0.5,1.45; 13 -1,1.45; 14 -1.5,1.45 | smd 3.3 x 1.7: GND 0,0
SO08 = smd 0.61 x 2.21: 1 -1.905,-2.616; 2 -0.635,-2.616; 3 0.635,-2.616; 4 1.905,-2.616; 5 1.905,2.616; 6 0.635,2.616; 7 -0.635,2.616; 8 -1.905,2.616
USB_MICRO_AB = smd 0.4 x 1.4: 1 -1.3,2.85; 2 -0.65,2.85; 3 0,2.85; 4 0.65,2.85; 5 1.3,2.85 | smd 2.3 x 1.9: GND1 -3.75,0; GND4 3.75,0 | smd 1.8 x 1.9: GND2 -1.15,0; GND3 1.15,0
ABM3C = smd 1.6 x 1.3: 1 -1.9,-1.15; 2 1.9,-1.15; 3 1.9,1.15; 4 -1.9,1.15
ABM8G = smd 1.4 x 1.2: GND-1 -1.1,0.85; GND-2 1.1,-0.85; X1 1.1,0.85; X2 -1.1,-0.85

### Placement (x,y rotation side)
AVR  16.25,53.5 90 top
BATTERY  7.74,67.34 180 top
C1  43,40.75 0 top
C2  41.75,32.75 0 top
C3  36.5,42.25 90 top
C4  39.75,38.75 0 top
C5  27.25,35.5 180 top
C6  28.25,40.5 90 top
C7  30.5,42.5 90 top
C8  38.5,34.75 0 top
C9  36,32 270 top
C10  34,32 270 top
C11  31.5,31.25 270 top
C12  26.75,33.5 180 top
C13  37.25,45.25 180 bottom
C14  40.5,45.25 0 bottom
C15  44.5,29 90 top
C16  43,24 270 top
C17  45,24 270 top
C18  36.6,29 90 top
C19  38.5,29 90 top
C20  31.5,18.75 180 top
C21  31.5,20.65 180 top
C22  38,26.5 0 top
C23  39,40.75 0 top
C24  25.25,28 180 top
C25  34,13.25 270 top
C26  34,6.25 270 top
C27  35,18.75 0 top
C28  35,10.75 0 top
C29  23.75,30.5 90 top
C30  42.5,78 270 bottom
C31  8.25,46.25 90 bottom
C32  17.25,46.25 90 bottom
C33  14.25,17 270 top
C34  16.25,17 270 top
C35  24,61.5 180 bottom
C36  21.75,17 270 top
C37  10.75,31.5 90 bottom
C38  12.75,31.5 90 bottom
C39  18.25,17 270 top
C40  11.25,43 90 bottom
C41  9.25,43 90 bottom
C42  10.25,46.25 90 bottom
C43  33.75,73.5 90 bottom
C44  35.75,73.5 90 bottom
C45  17,34.75 270 bottom
C46  41.75,75 0 bottom
C47  42.5,68.75 270 bottom
C48  8.5,40.5 0 bottom
C49  13.25,43 90 bottom
C50  8,36.75 0 bottom
C51  13.75,68.25 180 bottom
C52  8.75,65.75 0 bottom
C53  4.75,75.75 180 bottom
C54  17,57.25 90 bottom
CC1  43.25,45.25 270 top
CC8531  12.75,53.5 90 top
CCD  45.25,56.5 180 top
CHARGE  9.25,53.5 90 top
D1  21,57.75 270 top
D2  15.75,70.75 90 top
EXT  32.5,56 270 top
ICSP  26.75,54 90 top
IN  7.75,0.25 90 top
J1  34,2.25 90 top
L1  43,38.75 0 top
L2  41.75,34.75 0 top
L3  42.5,29 90 top
L4  29.5,45.75 90 top
L5  20.5,40 0 top
L6  23.75,39 0 top
L7  34,21.25 270 top
L8  34,16.25 270 top
L9  20.5,38 0 top
L10  35,8.75 180 top
L11  23.75,37 0 top
L12  38.5,36.75 0 top
L13  20.5,36 0 top
L14  6.25,46.25 90 bottom
L15  15.25,46.25 90 bottom
L16  21.5,61 270 bottom
L17  12.5,65.5 0 bottom
MICROSD  31.75,66.5 270 top
OUT  20,0.25 90 top
POWER  5.75,53.5 90 top
Q1  8.75,62.75 0 bottom
R1  41,47.75 90 bottom
R2  36.75,47.75 90 bottom
R3  7.25,53 90 bottom
R4  38.5,32.75 180 top
R5  31.5,45.75 90 top
R6  24.5,68.25 90 bottom
R7  23.5,34.5 180 top
R8  40.5,27 270 top
R9  28.75,27 90 top
R10  41.75,36.75 180 top
R11  40,78.75 0 bottom
R12  24.25,18.25 90 top
R13  24.25,21.5 90 top
R14  19,53 90 top
R15  14.25,21.5 90 top
R16  11.75,22.5 180 top
R17  5.25,36.5 270 bottom
R18  7.75,57 0 bottom
R19  14.5,56.25 0 bottom
R20  14.5,58.25 0 bottom
R21  10,58.75 180 bottom
R22  24.25,74.5 180 top
R23  19.5,74.5 180 top
RESET_AVR  38,76.5 90 top
SERIAL  45,64.75 90 top
SW1  23.75,78.25 180 top
U1  33.25,37.25 270 top
U2  33.05,26 270 top
U3  13,37.75 0 bottom
U4  34.25,66.5 180 bottom
U5  6.75,71 270 bottom
U6  12.5,61.5 0 bottom
U7  19.25,21.5 90 top
U$1  [HAMMOND_1455C802]  25,40 90 top
U$2  [PHONE_PLUG]  7.75,-3.75 270 top  (outside the outline)
U$3  [PHONE_PLUG]  20,-3.75 270 top  (outside the outline)
U$4  [MICROSD]  16.75,72 270 top
U$5  [35RAPC4BV4']  7.75,-41.25 0 top  (outside the outline)
U$6  [35RAPC4BV4']  20,-41.25 0 top  (outside the outline)
U$7  [1455C802]  25,-35 0 top  (outside the outline)
U$9  [TRANS_SILK]  43.5,13.5 0 top
U$10  [OSHW_FILLX150_NOTEXT]  19.5,44.5 0 top
U$11  [CONSMA003.062]  34,-40.7 0 top  (outside the outline)
USB  10,78.5 180 top
V_CHRG  12.75,72.75 270 bottom
X1  27.75,30.75 0 top
X2  41.75,72.25 90 bottom

### Tracks (layer width: path | path; a pad name or v marks a point on that pad's centre or on a via)
3.3V  (via drill 0.4)
  Top 0.4: D1.1 20.11,59.38 v20,59.75
  Bottom 0.2: U5.4 v3.75,70.25
  Bottom 0.3: 9.75,71 U5.2 v10.25,71
  other vias: 44,38.75 42.75,34.75 42.5,30 3.75,71.25 3.75,68.25 3.75,69.25 3.75,75.75 7.25,54 6.25,47.25 15.25,47.25 32.5,55 3.75,72.25 3.75,73.25
  pour Power (rank 2): 0,80 50,80 50,0 0,0
!SD_CARD  (via drill 0.4)
  Top 0.2: MICROSD.SWA 37.26,60.76 36.25,59.75 v30.75,59.75 | v27.25,62.5 v24,62.5
  Bottom 0.2: U4.32 27.55,69.3 R6.2 23.75,69.25 23.5,69 23.5,63 v24,62.5 | v30.75,59.75 28.5,59.75 28,60.25 28,61.75 v27.25,62.5
AGND  (via drill 0.4)
  Top 0.4: U7.5 18.38,23.37 v18.5,23.25 | U7.4 20.37,23.38 v20,23.5 | U7.3 20.11,22.14 v20,22.25
  Bottom 0.2: U3.17 10.53,35.52 v10.25,35.25
  Bottom 0.254: U3.17 10.53,36.02
  other vias: 5.25,35.5 14.25,16 16.25,16 1,3 1,1 1,15 1,13 1,11 1,9 1,7 1,5 1,27 1,25 1,23 1,21 1,19 1,17 1,35 1,33 1,31 1,29
  pour Ground: 13.25,35.5 11.25,35.5 11.25,37.25 9,39.5 7.5,39.5 7.5,36.25 0,36.25 0,0 25.5,0 25.5,25.75 13.25,25.75
  pour Top: 0,36.25 7.5,36.25 7.5,39.5 9,39.5 11.25,37.25 11.25,35.5 13.25,35.5 13.25,25.75 25.5,25.75 25.5,0 0,0
  pour Bottom: 0,36.25 7.5,36.25 7.5,39.5 9,39.5 11.25,37.25 11.25,35.5 13.25,35.5 13.25,25.75 25.5,25.75 25.5,0 0,0
AVDD  (via drill 0.4)
  Top 0.254: U1.31 37.4,35 C8.1 | U1.27 34,33.1 | 34,33.1 C10.1 | U1.28 34.5,33.35 C10.1 | U1.26 33.5,33.35 C10.1 | U1.23 32,32.6 C11.1 | U1.20 30.25,34.75 29,33.5 C12.1 27.65,33.5 | C10.1 34,32.75 | C9.1 34.1,33 34,33.1
  other vias: 37.5,34.75 36,33 34,33 31.5,32.25 40.75,32.75 40.75,34.75 27.75,33.5
  pour Power: 41.5,31.5 26.75,31.5 26.75,34.25 30.75,34.25 30.75,35.75 41.5,35.75
AVDD_2591  (via drill 0.4)
  Top 0.254: U2.10 32.75,24.1 32.75,20.65 C21.1 | U2.13 42.83,25.02 C16.1 42.9,24.85 42.75,25 | U2.1 36.35,27.9 C18.1 | U2.16 36.67,26.98 C22.1 37.1,26.5 | 38.5,28.1 C19.1
  Top 0.46: C21.1 C20.1 | C18.1 C19.1 | C16.1 C17.1 | 38.5,28.1 38.5,28.25
  other vias: 36.6,28 43,25 45,25 32.5,20.65 32.5,18.75 42.5,28 38.5,28 37,26.5 28.75,28 44.5,28
  pour Power: 26.75,28.75 46,28.75 46,18 26.75,18
AVDD_CODEC  (via drill 0.4)
  Top 0.4: U7.8 16.63,18.38 C34.1 C33.1
  Bottom 0.3: U3.26 11.75,41.5 C40.1 10.25,42 | C41.1 10.25,42 | C42.1 10.25,42
  other vias: 6.25,45.25 8.25,45.25 10.25,45.25 9.25,42 11.25,42 16.25,18 14.25,18
  pour Power: 4,45.75 13.25,46 13.25,25.75 25.5,25.75 25.5,15 4,14.75
AVR_PWR  (via drill 0.4)
  Top 0.4: MICROSD.VDD 30.8,66.69 30.75,66.75 30.75,70 v30.5,70.25
  Bottom 0.2: 33.85,71.6 C43.1 | 35.5,72.5 C44.1
  Bottom 0.4: U4.4 33.85,71.6 33.85,72.4 C43.1 | U4.6 35.45,72.2 C44.1 | U4.18 v36.25,61.25 | L16.1 C35.1
  Bottom 0.5: 33.85,72.4 35.65,72.4 C44.1
  other vias: 35.75,72.5 39,78.75 23,61.5 24.5,67.25
  pour Power: 22.5,60.75 43,60.75 43,71.75 46.5,71.75 46.5,80 22.5,80
BAT  (via drill 0.4)
  Top 0.5: BATTERY.1 8.99,69.74 8.75,69.5 8.75,64.5 v7.5,63.25
  Bottom 0.3: U6.9 11.5,63.4 11.25,63.65 10.4,63.65 9.5,62.75 8.25,62.75 7.8,62.3 Q1.2
  Bottom 0.5: v7.5,63.25 7.5,62 7.75,61.75 Q1.2
BCLK  (via drill 0.4)
  Top 0.254: L6.1 v18.75,39
  Bottom 0.254: U3.2 v18.75,39
CS_CC8531  (via drill 0.4)
  Top 0.2: U1.3 34.5,45.5 41.4,52.4 41.4,55.8 40.7,56.5 CCD.5 39.5,56.5 37,59 30.5,59 30,59.5 30,62.5 v30.25,62.75
  Bottom 0.2: v30.25,62.75 U4.25
CS_CODEC  (via drill 0.4)
  Top 0.2: v21.75,51.25 28,51.25 28.75,52 v28.75,57.75
  Bottom 0.2: v21.75,51.25 21,51.25 20,50.25 20,32.75 19.5,32.25 16,32.25 15.5,32.75 15.5,35 15.22,35.27 U3.9 | v28.75,57.75 31.75,57.75 32.25,58.25 U4.23
CS_SD  (via drill 0.4)
  Top 0.2: v30.75,61.5 31,61.75 31,64.25 31.25,64.5 MICROSD.CD/DAT3
  Bottom 0.2: U4.24 31.45,62.2 v30.75,61.5
CTS
  Bottom 0.2: U4.12 38.85,66.9 39.25,66.5 44.21,66.5 SERIAL.2
D0  (via drill 0.4)
  Top 0.2: v15.75,64 16.25,64 16.75,64.5 28,64.5 28.5,65 28.5,73.75 31,76.25 37.25,76.25 40.75,72.75 v40.75,68
  Bottom 0.2: U6.13 13.5,63.5 13.65,63.65 15.4,63.65 v15.75,64 | U4.11 40.55,67.7 v40.75,68
D1  (via drill 0.4)
  Top 0.2: v15.75,63 16,63 17,64 28.5,64 29,64.5 29,73.5 31.25,75.75 37,75.75 40,72.75 v40,68.75
  Bottom 0.2: U6.14 14.55,62.95 v15.75,63 | U4.10 39.75,68.5 v40,68.75
D2  (via drill 0.4)
  Top 0.2: v11.75,56.75 11.75,56.5 12.25,56 16.5,56 16.75,56.25 16.75,63 17.25,63.5 28.75,63.5 29.5,64.25 29.5,73.25 31.5,75.25 36.5,75.25 39.25,72.5 39.5,72.5 39.5,69.75 v39.25,69.5
  Bottom 0.2: U6.4 12.5,59.5 12.05,59.05 12.05,58.05 11.75,57.75 v11.75,56.75 | U4.9 39.05,69.3 v39.25,69.5
D+  (via drill 0.4)
  Top 0.2: USB.3 10,74.75 9.75,74.5 2.75,74.5 2.25,74 2.25,50 3.5,48.75 28.25,48.75 | 28.25,48.75 v30,48.75 | v24.75,41.25 24.75,41.5 25.75,42.5 27.5,42.5 28.25,43.25 28.25,48.75
  Bottom 0.2: v30,48.75 30.75,48.75 31.25,49.25 36.25,49.25 R2.2 | R7.2 24,34.5 24.75,35.25 v24.75,41.25
  other vias: 22.5,34.5
D-  (via drill 0.4)
  Top 0.2: USB.2 10.65,74.4 10.25,74 3,74 2.75,73.75 2.75,50.25 3.5,49.5 v29.25,49.5
  Bottom 0.2: v29.25,49.5 30,49.5 30.25,49.75 39.75,49.75 R1.2
DIN  (via drill 0.4)
  Top 0.254: L13.1 v18.5,36
  Bottom 0.254: U3.4 17.25,38 18,37.25 18,36.5 v18.5,36
DOUT  (via drill 0.4)
  Top 0.254: v17.25,37 L11.1
  Bottom 0.254: U3.5 16.75,37.5 v17.25,37
DVDD
  Bottom 0.3: U3.29 C49.1
DVDD_CODEC  (via drill 0.4)
  Bottom 0.2: U3.12 13.25,34 v13.75,33.5
  Bottom 0.254: U3.6 16.25,37 16.5,36.75 16.5,36.25 C45.1
  Bottom 0.3: U3.30 13.75,41 v14.5,41.75
  other vias: 15.25,45.25 17.25,45.25 17,35.75
  pour Power: 13.75,46 18,46 18,32.75 13.75,32.75
GND  (via drill 0.4)
  Top 0.2: C21.2 v30.5,20.6 | v34.75,24 34,24 | 31.5,2.25 v31.5,1 | 36.5,2.25 v36.5,1 | J1.GND3 31.5,2.25 | 31.5,2.25 v31.5,3.5 | J1.GND4 36.5,2.25 | 36.5,2.25 v36.5,3.75
  Top 0.254: U1.8 32,38.5 U1.GND 33.5,37 | U1.29 35,35.5 v33.75,36.75 | U1.34 34,36.5 v33.75,36.75 | v33.75,36.75 33.5,37 | U1.35 33.5,37 | U2.8 32.08,25.02 | U2.9 32.08,25.02 | 32.08,25.02 U2.GND | U2.12 34.02,25.02 U2.GND | U2.14 33.38,25.68 U2.GND | X1.2 29.65,29.65 v29.75,29.5 | X1.4 v26,31.75 | USB.GND3 8.85,78.65 v8.5,79 | USB.GND2 11.15,78.35 v11.5,78
  Top 0.5: USB.5 8.7,78.35 USB.GND3
  Bottom 0.2: U4.3 33.05,67.7 33.25,67.5 | U4.5 34.65,66.9 | U4.21 33.85,66.1 | X2.GND-1 42.75,71
  Bottom 0.254: U3.28 12.75,38 U3.GND 14.25,36.5 U3.7 | v11.5,61.5 U6.GND
  Bottom 0.3: U6.1 14,61 v13.5,61.5 U6.GND | C54.2 R20.1
  Bottom 0.5: 9.85,73.6 9.85,73.4 9.75,73.75 | U5.1 9.85,73.6 | 9.85,73.6 9.5,74 | X2.GND-2 40.9,74.85 C46.2
  other vias: 31.5,30.25 34,31 36,31 38.5,30 36.6,30 44.5,30 42.75,32.75 42.75,36.75 44,40.75 40.5,28 30.5,18.75 36.5,43.25 40,40.75 30.5,43.5 28.25,41.5 26.25,35.5 25.75,33.5 24.25,28 23.75,31.5 31.75,38.75 32.75,38.75 33.75,38.75 34.75,38.75 34.75,37.75 33.75,37.75 32.75,37.75 31.75,37.75 31.75,36.75 32.75,36.75 34.75,36.75 34.75,35.75 33.75,35.75 32.75,35.75 31.75,35.75 33.25,68.5 36.25,68.5 35.25,68.5 34.25,68.5 34.25,67.5 35.25,67.5 40.75,75 42.5,67.75 13.25,79 14.25,79 14.25,78 13.25,78 10.75,79 9.25,78 5.75,79 6.75,79 6.75,78 5.75,78 9,58.75 5.75,75.75 31.25,24.1 32.55,26.5 33.55,26.5 33.55,25.5 32.55,25.5 36,18.75 36,10.75 36,8.75 39,26.5 43,23 45,23 39.5,32.75 39.5,34.75 40.75,38.75 5.75,55 12.75,55 16.25,55 15.5,58.25 38.25,45.25 39.5,45.25 13,37.75 12,38.75 13,38.75 14,38.75 14,37.75 12,37.75 12,36.75 13,36.75 14,36.75 11.25,44 10.25,47.25 8.25,47.25 9.25,44 13.25,44 7.5,40.5 7,36.75 17.25,47.25 17,33.75 5.25,37.5 32,16.75 32,14.75 32,12.75 32,10.75 32,8.75 32,6.75 36,6.75 36,12.75 36,14.75 36,16.75 36,22.75 36,21 49,11 49,9 49,7 49,5 49,3 49,1 49,23 49,21 49,19 49,17 49,15 49,13 49,35 49,33 49,31 49,29 49,27 49,25 49,45 49,41 49,39 49,37 49,59 49,57 49,55 49,53 49,51 49,49 49,71 49,69 49,67 49,65 49,63 49,61 49,79 49,77 49,75 49,73 1,47 1,45 1,43 1,41 1,39 1,37 1,59 1,57 1,55 1,53 1,51 1,49 1,71 1,69 1,67 1,65 1,63 1,61 1,79 1,77 1,75 1,73 25,61.5 18.5,74.5 23.25,74.5 34,61 36.25,67.5 36.25,66.5 35.25,66.5 34.25,66.5 37.25,73 6.75,72.75 6.75,71.75 6.75,70.75 28.5,76.25
  pour Ground (rank 2): 0,80 50,80 50,0 0,0
  pour Top (rank 2): 0,80 50,80 50,0 0,0
  pour Bottom (rank 2): 0,80 50,80 50,0 0,0
IN_L
  Bottom 0.4: IN.2 9.9,3.9 10.75,4.75 10.75,11.1 IN.5 10.5,13.25 12.75,15.5 C38.1
IN_R
  Bottom 0.4: IN.3 8.5,7.6 IN.4 6.6,14.85 7.5,15.75 9.25,15.75 10.75,17.25 C37.1
IOVDD  (via drill 0.4)
  Top 0.254: U1.37 38.15,38 C4.1 v38.85,38.75 | U1.40 36.25,40.9 C3.1 | U1.12 28.75,39 C6.1 | U1.18 28.75,36 28.4,35.65 | 28.4,35.65 C5.1 28.15,35.5 28.4,35.65 | U1.10 30.5,40.75 C7.1 30.5,42
  other vias: 36.5,41.25 30.5,41.5 28.25,39.5 42,38.75 42,40.75 28.25,35.5
  pour Power: 30.25,34.75 26.75,34.75 26.75,42.5 42.5,42.5 42.5,38 36.25,38 36.25,40.25 30.25,40.25
IOVDD1  (via drill 0.4)
  Top 0.2: U1.1 35.5,43.75 36,44.25 41.25,44.25 41.5,44.5 C14.1
  Bottom 0.2: R1.1 41,45.75 C14.1
  other vias: 41.5,45.25
IOVDD2  (via drill 0.4)
  Top 0.2: U1.2 35,44 C13.1
  Bottom 0.2: 36,45 C13.1 36.25,46.25 R2.1
  other vias: 36.25,45.25
LNA_EN  (via drill 0.4)
  Top 0.2: U2.6 30.43,26.32 v29.75,27 | v37.5,38.75 37.25,38.75 37,38.5 U1.38
  Bottom 0.2: v29.75,27 29.75,28 31.25,29.5 34.5,29.5 35,30 35,33.75 36.25,35 36.25,37.5 v37.5,38.75
MCLK  (via drill 0.4)
  Top 0.254: L5.1 v18.25,40
  Bottom 0.254: U3.1 17.75,39.5 v18.25,40
MISO  (via drill 0.4)
  Top 0.2: U1.6 33,47 v34,48 35.09,49.09 CCD.10 32.21,53.96 v32,53.75 | MICROSD.DAT0 36.76,70 38,68.75 38,66.75 38.75,66 40.25,66 41,65.25 41,60.25 40.25,59.5 v38.25,59.5
  Bottom 0.2: 35.09,54 CCD.10 35.66,53.96 36.4,54.7 36.4,57.4 37,58 38,58 38.25,58.25 v38.25,59.5 38.25,60 38.25,60.75 39,61.5 39,63.5 38.8,63.7 U4.16 | v34,48 33,47 33,43 32.5,42.5 22.5,42.5 21.5,41.5 21.5,32.75 20,31.25 15.5,31.25 14.5,32.25 14.5,34 14.25,34.25 14,34.25 13.75,34.5 U3.11 | v32,53.75 27,53.75 ICSP.1
MOSI  (via drill 0.4)
  Top 0.2: U1.5 33.5,46 37.63,50.13 CCD.8 | MICROSD.CMD 32.66,65.59 33,65.25 33,64.75 33.25,64.5 39,64.5 v39.5,64
  Bottom 0.2: 37.79,53.96 CCD.8 38.36,53.96 38.9,54.5 38.9,55.25 | U4.15 39,64.5 v39.5,64 39.5,59 38.9,58.4 38.9,55.25 | 23,51.75 23,55.5 24.04,56.54 ICSP.4 24.17,56.5 | 23,51.75 40.15,51.75 41.4,53 41.4,54.85 41,55.25 38.9,55.25 | 23,51.75 23,50.75 22.5,50.25 21.75,50.25 20.75,49.25 20.75,32.75 19.75,31.75 15.75,31.75 15,32.5 15,34.25 14.75,34.5 14.5,34.5 14.25,34.75 U3.10
N$1
  Top 0.254: U1.21 30.5,34.25 29.25,33 28.75,33 28.25,32.5 27.25,32.5 27,32.25 27,29.75 26.85,29.6 X1.1 25.75,29.5 25.6,29.65 25.65,29.65 | C29.1 25.5,29.5 25.65,29.65 | 25.65,29.65 25.75,29.75
N$2
  Top 0.254: U1.22 31.5,33.5 31.25,33.25 30.25,33.25 29.65,32.65 X1.3 27.9,31.9 27.5,31.5 27.5,28.75 26.75,28 C24.1
N$3
  Top 0.254: U1.11 30.25,39.75 29.5,40.5 L4.1
N$4
  Top 0.254: U1.16 L11.2
N$5
  Top 0.254: L6.2 25,39 26,38 U1.14
N$6  (via drill 0.4)
  Top 0.4: D1.3 21.89,59.62 L16.2
  other vias: 21.5,60
N$7
  Top 0.254: U2.15 35.67,26.32 36.5,25.5 40,25.5 R8.2
N$8
  Top 0.254: U2.7 29.21,25.68 R9.1
N$9
  Top 0.46: C26.2 J1.SIG
N$10  (via drill 0.4)
  Top 0.5: D2.3 11.5,70.75 10,69.25 v10,68.85
  Bottom 0.5: v10,68.85 10,68.25 9.8,68.3 | U5.3 9.8,68.3 | 9.8,68.3 9.75,68.25
N$11  (via drill 0.4)  (1 unrouted)
  Top 0.2: U1.7 32.5,47.5 33,48 33,50.25 v33.5,50.75 | v47.5,49.75 47.5,47.75 47.75,47.5 CC1.3 | CC1.4 38.75,47.5
  Bottom 0.2: v33.5,50.75 47,50.75 47.5,50.25 v47.5,49.75
N$12
  Bottom 0.2: C46.1 42.6,74.85 X2.X1 42.35,72.85 41.75,72.25 37.25,72.25 36.25,71.25 U4.7
N$13
  Top 0.46: U2.11 33.38,22.73 L7.1
N$14
  Top 0.46: L7.2 C27.1 L8.1
N$15
  Top 0.46: L8.2 C25.1
N$16
  Top 0.46: C25.2 C28.1 34,8.5 | 34,8.5 C26.1 | 34,8.5 34.15,8.65 L10.2
N$17
  Bottom 0.254: U3.24 10.53,39.98 10,40.5 C48.1
N$18
  Top 0.254: U1.36 36.9,37.5 37.5,36.9 L12.1
N$19
  Top 0.254: U1.30 36.5,34.25 37.65,33.1 R4.2
N$20
  Bottom 0.2: X2.X2 40.6,71.15 | 40.75,71 X2.X2 | U4.8 40,70.5 40.49,70.86 | 40.49,70.86 X2.X2 | C47.1 41.6,69.75 40.49,70.86
N$21
  Top 0.254: U1.39 36.75,39 37.5,39.75 37.75,39.75 38.15,40.15 C23.1
N$23
  Top 0.254: U1.13 26.75,38.5 25.25,40 L5.2
N$24
  Top 0.254: R7.1 29,34.5 29.25,34.75 29.25,35.25 29.5,35.5 U1.19
N$25
  Top 0.254: U1.15 25.75,37.5 25.25,38 L9.2
N$27
  Top 0.254: U1.17 25.75,36.5 25.25,36 L13.2
N$28
  Top 0.254: U1.9 R5.1
N$29  (via drill 0.4)
  Top 0.3: CC8531.A 12.75,50.5 13,50.25 29.75,50.25 v31.5,48.5
  Bottom 0.3: v31.5,48.5 R5.2
  other vias: 31.5,46.75
N$31  (via drill 0.4)
  Top 0.4: POWER.A R3.1
  other vias: 7.25,52
N$32  (via drill 0.4)
  Top 0.3: v10.5,55 CHARGE.C
  Bottom 0.2: 10,59.5 10,57.5
  Bottom 0.3: U6.7 10.3,60.05 10,59.75 10,59.5 | 10,57.5 10,55.5 v10.5,55
N$33  (via drill 0.4)
  Bottom 0.3: R18.1 8.75,52.5 CHARGE.A
  other vias: 9.25,52
N$34
  Bottom 0.3: U3.14 12.25,34.25 12,34 11.25,34 10.75,33.5 C37.2
N$35
  Bottom 0.3: U3.13 C38.2
N$36
  Bottom 0.3: U6.12 13,65.25 13.25,65.5 L17.1
N$37
  Bottom 0.3: U6.5 U6.6 11.5,59 R21.2
N$38
  Bottom 0.254: R20.2 R19.2
  Bottom 0.3: U6.2 R20.2
N$39
  Top 0.4: U7.1 21.75,19.48 C36.1 23.5,18 R12.1
N$40
  Top 0.4: C39.1 18.25,20.5 17.89,20.86 U7.7 14.62,20.86 R15.1
N$46  (via drill 0.4)
  Bottom 0.3: U4.1 31.45,71.05 29.25,71 20.5,71 19,69.5 R14.2
  other vias: 19,54
N$47
  Top 0.3: AVR.A R14.1
N$48
  Bottom 0.254: C54.1 R19.1
N$49  (via drill 0.4)
  Top 0.2: 12.5,60.75 12.5,61.75 11.25,63 10.25,63 9.75,63.5
  Top 0.254: v12.5,57.5 12.5,60.75 | C52.1 9.75,63.5
  Top 0.3: 16.25,70.75 16,70.75 15.75,70.5 15.75,70 15.5,69.75
  Top 0.5: SW1.3 22.25,72 21,70.75 16.25,70.75 | 15.5,69.75 14.25,68.75 13.25,68.75 12.5,68 10,68 9.75,67.75 C52.1
  Bottom 0.254: U6.3 13,59.25 12.5,58.75 v12.5,57.5
  Bottom 0.3: U6.10 12,65.25 11.75,65.5 L17.2
  Bottom 0.5: Q1.3 9.1,63.85 9.1,65.1 C52.1 10.75,65.75 L17.2 11,64.5
  other vias: 9.75,65.75
N$50
  Top 0.4: CCD.9 32.87,56.5 EXT.1
N$51
  Bottom 0.3: U6.8 10.95,62.95 10.5,62.5 10.5,62 10.25,61.75 Q1.1
N$52
  Bottom 0.3: U6.11 12.5,68 C51.1 | R18.2 5.75,57 5.5,57.25 5.5,68.75 6.75,70 12.75,70
  Bottom 0.5: C51.1 12.75,70 V_CHRG.2
N$53
  Top 0.4: U7.2 23.89,20.86 R13.1 R12.2
N$54
  Top 0.4: U7.6 14.62,22.14 R15.2 R16.1
N$55  (via drill 0.4)
  Top 0.3: v9.25,38 9.25,25.25 10,24.5 23.5,24.5 24.25,23.75 R13.2
  Bottom 0.3: U3.22 9.75,38.5 v9.25,38
N$56  (via drill 0.4)
  Top 0.3: v8.25,38.75 8.25,23.75 9.5,22.5 R16.2 11,22.5
  Bottom 0.3: U3.23 8.5,39 v8.25,38.75
ON_RX  (via drill 0.4)
  Top 0.2: R23.1 20.75,74.25 | v27.25,65.25 27,65 17.5,65 17,65.5 17,68.25 17.5,68.75 v18,68.75
  Top 0.5: D2.2 v18,71.7 19.95,71.7 20.75,72.5 20.75,74.25 SW1.4
  Bottom 0.2: 27.5,65.25 v27.25,65.25 27.3,65.3 U4.27 | v18,68.75 v18,71.7
ON_TX  (via drill 0.4)
  Top 0.2: 23.8,69.8 23.75,69.75 24.75,69.75 25.25,69.25 25.25,66 25.5,65.75 v26.25,65.75
  Top 0.5: D2.1 23.8,69.8 25.25,71.25 R22.1 SW1.2
  Bottom 0.2: U4.28 26.6,66.1 v26.25,65.75
OUT_L
  Top 0.4: C36.2 21.75,14.15 OUT.5 22.75,11.35 22.75,5 21.65,3.9 OUT.2
OUT_R
  Top 0.4: C39.2 18.25,10.1 OUT.4 20.75,7.6 OUT.3
PA_EN  (via drill 0.4)
  Top 0.2: v31,27.75 31,27.12 U2.5
  Top 0.254: 40.6,36.75 R10.2 L12.2
  Bottom 0.2: L12.2 38.75,36.75 38.5,36.5 38.5,31.75 37.5,30.75 37.5,29.25 37.25,29 31.5,29 31,28.5 v31,27.75
  other vias: 39.5,36.75
PROG_PWR
  Top 0.5: D1.2 20.11,56.63 22.75,54 ICSP.2
  pour Power: 22.5,51 22.5,60.25 43.5,60.25 43.5,71.25 46.5,71.25 46.5,58 28.25,58 28.25,51
REF
  Bottom 0.254: U3.18 9.25,36.5 C50.1
RESET_AVR  (via drill 0.4)  (1 unrouted)
  Top 0.2: RESET_AVR.4 42.55,74.7 v40.75,76.5 40,77.25 30.5,77.25 27,73.75 v27,66.9
  Bottom 0.2: U4.29 v27,66.9 26.15,66.9 25.5,66.25 25.5,65.25 26,64.75 26,61.5 26.75,60.75 ICSP.5 | R11.1 41,76.75 | 41,76.75 v40.75,76.5 | C30.2 41.25,77 41,76.75
RESET_CC8531  (via drill 0.4)
  Top 0.2: L4.2 30.5,47.75 32,47.75 32.25,48 32.25,49 29.5,51.75 29.5,58.65 | CCD.7 35.5,58.63 29.62,58.63 29.5,58.65 | 29.5,58.65 29.5,60.75 v29.25,61 | v15.75,41 22.5,41 24.5,43 24.5,46.25 25,46.75 v26.75,46.75
  Bottom 0.2: U3.31 14.25,40.75 14.5,41 v15.75,41 | v26.75,46.75 L4.2 | U4.26 29.5,64.5 29.25,64.25 v29.25,61
  other vias: 29.5,46.75
RF_N
  Top 0.254: U1.25 33,29.5 33.38,29.12 U2.2
RF_P
  Top 0.254: U1.24 32.5,29.5 32.08,29.07 U2.4
RTS/DTS
  Bottom 0.2: C30.1 43.45,79 SERIAL.6
RX  (via drill 0.4)
  Top 0.2: v27.75,68.5 27.75,73.75 30.75,76.75 37.5,76.75 41.88,72.37 SERIAL.4
  Bottom 0.2: v27.75,68.5 U4.31
SCLK  (via drill 0.4)
  Top 0.2: U1.4 34,45.75 40.17,51.92 CCD.6 | ICSP.3 25.84,56.54 25.5,56.2 25.5,52.75 25,52.25 v20.75,52.25 | MICROSD.CLK 32.95,67.8 33.5,67.25 33.5,65.5 34,65 40.25,65 40.5,64.75 40.5,63 40,62.5 v38,62.5
  Bottom 0.2: CCD.6 40.17,52.92 39.75,52.5 34.25,52.5 33.75,53 33.75,56.54 | 33.75,56.54 33.75,58 34,58.25 36.5,58.25 37.05,58.8 U4.17 v38,62.5 | ICSP.3 33.75,56.54 | v20.75,52.25 20,52.25 19.5,51.75 19.5,33.25 19,32.75 16.25,32.75 16,33 16,35.48 U3.8
TX  (via drill 0.4)
  Top 0.2: v26.25,67.75 26.25,73.75 27.75,75.25 27.75,77.5 28.25,78 29.5,78 29.75,77.75 40.5,77.75 41,77.25 42.5,77.25 45,75 SERIAL.5
  Bottom 0.2: v26.25,67.75 30,67.75 30.2,67.7 U4.30
VBUS  (via drill 0.4)
  Top 0.5: USB.1 12.35,75.65 v12.75,75.25
  Bottom 0.5: v12.75,75.25 V_CHRG.1
WCLK  (via drill 0.4)
  Top 0.254: L9.1 v18.25,38
  Bottom 0.254: U3.3 17.75,38.5 v18.25,38

### Text on the board
tPlace: RTS | TXD | RXD | VDD | CTS | GND | GND | RESET | RESET | CSn | GND | SCLK | MOSI | VDD | MISO | MISO | MOSI | SCLK | VDD | open | hardware | PCB designed for | 4-layer 1.6mm | stackup: FR-4 | prepreg and | with 2 x 2116 | 1oz copper | Use RP-SMA (M) | antenna | Eva Kloiber | Feb 2013
tDocu: On - Tx | On - Rx | Off | AVDD_PA1 | 1.85mm | 6.90mm | AVDD_LNA | AVDD_PA2 | 2.40mm